# EAGLE design RTC (EAGLE 5.10)
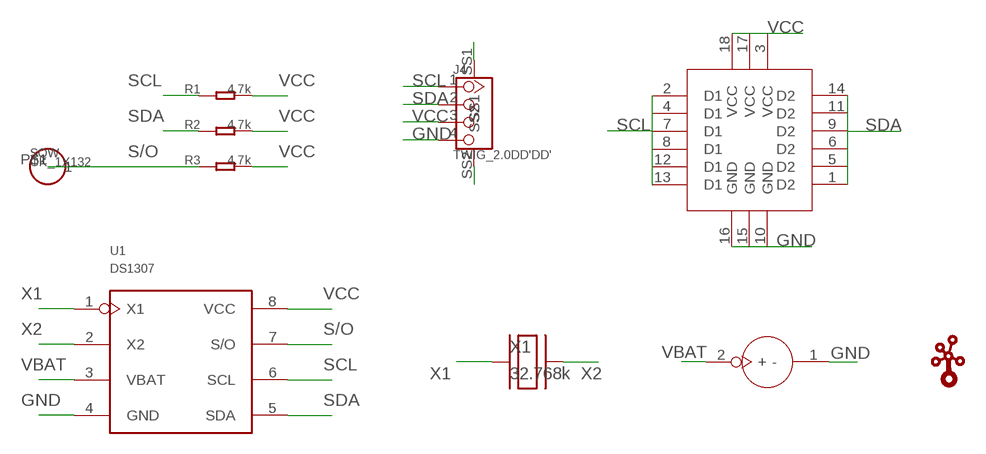
[diagram p0: schematic, sheet 1]

## Parts
J4  TWIG_2.0DD'DD'  [2.0_1X4DD]
R1  4.7k  R0603  [0603]
R2  4.7k  R0603  [0603]
R3  4.7k  R0603  [0603]
SQW  CK_1X132  [CK_1X1]
TWIG1  TWIG-U2  [U2]
U1  DS1307  [SO08]
U3  BATTERYBATTERY1225_SMT  [BATTERY1225_SMT]
U$2  TWIGLOGOTWIGLOGO_SMALL  [TWIGLOGO_SMALL]
X1  32.768k  XTL_S  [XTL_S]

## Nets
GND: J4.4 J4.SS1 J4.SS2 TWIG1.10(GND) TWIG1.15(GND) TWIG1.16(GND) U1.4(GND) U3.1(-)
S/O: R3.1 SQW.P$1 U1.7(S/O)
SCL: J4.1 R1.1 TWIG1.2(D1) TWIG1.4(D1) TWIG1.7(D1) TWIG1.8(D1) TWIG1.12(D1) TWIG1.13(D1) U1.6(SCL)
SDA: J4.2 R2.1 TWIG1.1(D2) TWIG1.5(D2) TWIG1.6(D2) TWIG1.9(D2) TWIG1.11(D2) TWIG1.14(D2) U1.5(SDA)
VBAT: U1.3(VBAT) U3.2(+)
VCC: J4.3 R1.2 R2.2 R3.2 TWIG1.3(VCC) TWIG1.17(VCC) TWIG1.18(VCC) U1.8(VCC)
X1: U1.1(X1) X1.1
X2: U1.2(X2) X1.2

## Library data of the parts
J4 = CONNECTER:TWIG_2.0DD
R1-R3 = CPT_SMD:R0603
SQW = CONNECTER:CK_1X1
TWIG1 = twig_template2:TWIG-U2
U1 = Seeed:DS1307
U3 = seeedleo:BATTERY
U$2 = seeedleo:TWIGLOGO
X1 = CPT_CJ:XTL_S

## Board
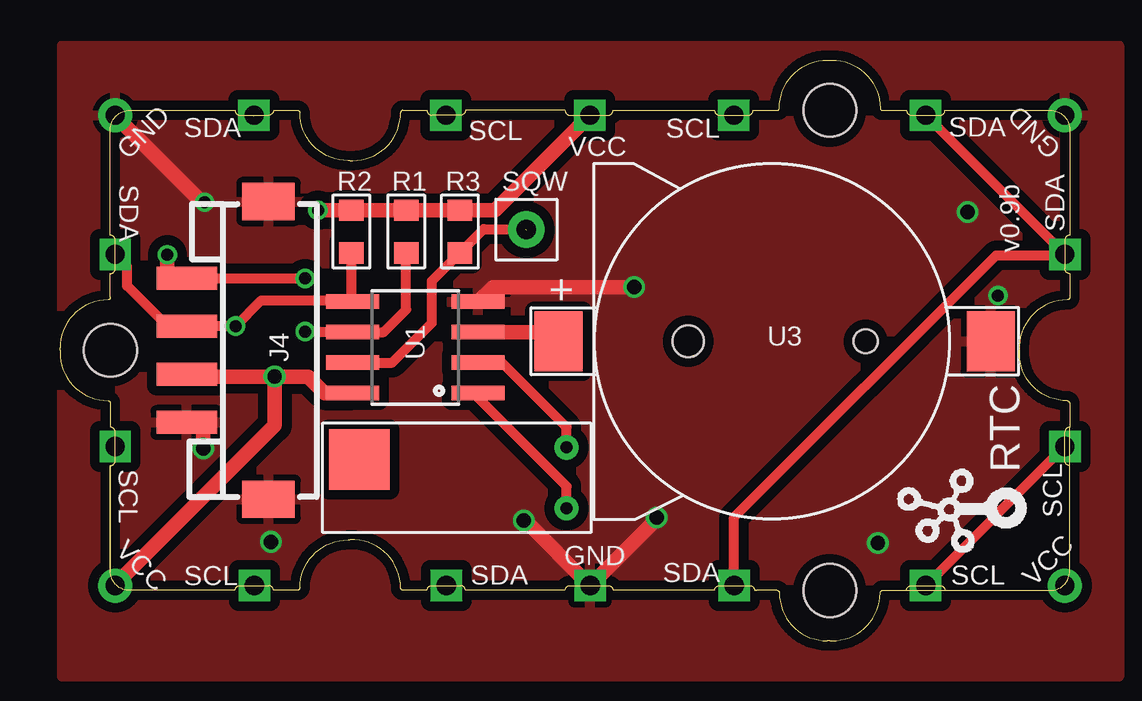
[diagram p1: board, top side]
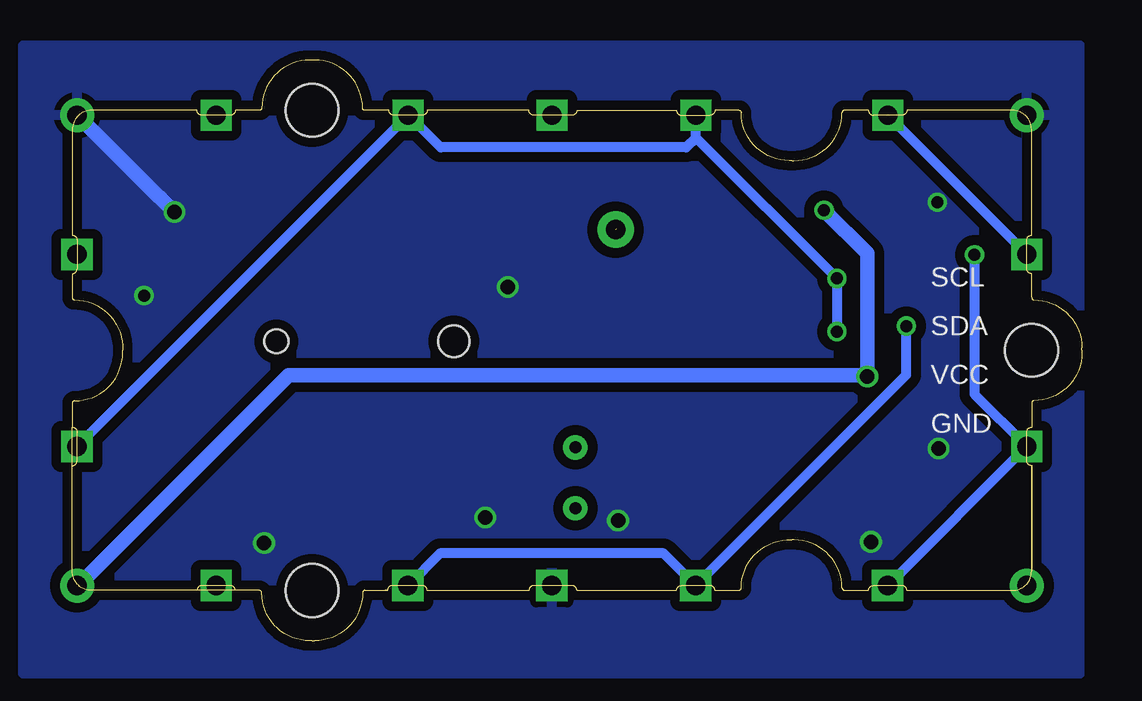
[diagram p2: board, bottom side, seen from below]

Size 42.09 x 24.2 mm. Coordinates in mm from the lower left corner, seen from the top.
Copper layers (1*16): Top 0.035mm / dielectric 1.5mm / Bottom 0.035mm
Design rules "SeeedStudio_rule_no_angle_090911": minimum track width 6mil, minimum drill 12mil, track to track 6mil, track to pad 6mil, pad to pad 6mil, via to via 6mil, smd to smd 0mil, copper to edge 10mil, drill to drill 10mil, minimum pad ring 10mil, minimum via ring 6mil, stop-mask expansion 2mil, vias tented up to drill 100mil, thermal gap 10mil

### Footprints (pad centres in the part's own frame; a part is rotated, then mirrored left to right if it is on the bottom)
2.0_1X4DD = smd 0.965 x 2.54: 1 -3,0; 2 -1,0; 3 1,0; 4 3,0 | smd 1.55 x 2.184: SS1 -6.2,3.4; SS2 6.2,3.4
0603 = smd 0.889 x 1.016: 1 -0.889,0; 2 0.889,0
CK_1X1 = drill 0.813 pad 1.524 round: P$1 0,0
U2 = drill 0.8 pad 1.27 square: 1 -13.965,9.8; 2 -5.965,9.8; 3 0.035,9.8; 4 6.035,9.8; 5 14.035,9.8; 6 19.835,4; 7 19.835,-4; 8 14.035,-9.8; 9 6.045,-9.8; 10 0.045,-9.8; 11 -5.955,-9.8; 12 -13.955,-9.8; 13 -19.755,-4; 14 -19.755,4 | drill 0.8 pad 1.422 round: 15 -19.755,9.8; 16 19.835,9.8; 17 19.835,-9.8; 18 -19.755,-9.8 | hole 2.2: 10.033,-10; 10.033,10; -19.955,0.005
SO08 = smd 0.61 x 2.21: 1 -1.905,-2.616; 2 -0.635,-2.616; 3 0.635,-2.616; 4 1.905,-2.616; 5 1.905,2.616; 6 0.635,2.616; 7 -0.635,2.616; 8 -1.905,2.616
BATTERY1225_SMT = smd 2 x 2.5: 1 -9.119,0; 2 8.89,0 | hole 1: -3.913,0 | hole 1.3: 3.487,0
XTL_S = drill 0.508 round: 1 0,0; 2 0,-2.54 | smd 2.54 x 2.54:  8.636,-2.032

### Placement (x,y rotation side)
J4  5.29,12.1 270 top
R1  14.43,17.05 90 top
R2  12.15,17.05 90 top
R3  16.67,17.05 90 top
SQW  19.44,17.13 270 top
TWIG1  22.05,12.1 0 top
U1  14.82,12.23 90 top
U3  29.67,12.48 180 top
U$2  40.42,3.29 90 top
X1  21.12,5.52 180 top

### Tracks (layer width: path | path; a pad name or v marks a point on that pad's centre or on a via)
GND  (via drill 0.5, 0.6)
  Top 0.61: v19.34,5.01 19.39,5.01 TWIG1.10 24.94,5.14 v24.87,5.14 | TWIG1.15 2.3,21.87 5.9,18.27 v6.03,18.27 | J4.SS1 8.66,18.27 | v5.98,8.01 5.98,9.05 5.93,9.1 J4.4 | v23.93,14.74 18.04,14.74 U1.4
  Bottom 0.61: TWIG1.16 38.49,18.5 38.46,18.5 v37.83,17.87 | v6.03,18.27 5.98,18.22
  other vias: 34.09,4.07 39.1,14.39 8.8,4.12
  pour Top (isolate 0.406): 0.08,24.8 44.15,24.8 44.15,-1.49 0.08,-1.49
  pour Bottom (isolate 0.406): 0.08,24.8 44.15,24.8 44.15,-1.36 0.08,-1.36
S/O  (1 unrouted)
  Top 0.406: U1.7 13.85,11.59 15.5,13.24 15.5,15 R3.1 | R3.1 16.75,16.16 | 19.41,17.16 17.66,17.16 R3.1
SCL  (via drill 0.5)
  Top 0.406: TWIG1.7 TWIG1.8 | J4.1 v10.22,15.1 | v10.22,12.89 12.17,12.89 U1.6 13.49,12.86 14.43,13.8 R1.1
  Top 0.61: J4.1 4.56,15.1 4.48,15.02 v4.48,16.09
  Bottom 0.406: TWIG1.12 TWIG1.13 4.48,10.28 v4.48,16.09 | TWIG1.7 TWIG1.4 28.07,21.9 26.73,20.56 16.5,20.56 16.09,20.97 | v10.22,12.89 v10.22,15.1 16.09,20.97 | 16.09,20.97 TWIG1.2
SDA  (via drill 0.5)  (1 unrouted)
  Top 0.406: 12.15,14.18 R2.1 | 12.15,14.18 U1.5 | 12.15,14.18 8.39,14.18 v7.32,13.12 6.04,13.12 J4.2 4.49,13.1 2.8,14.79 2.8,15.6 TWIG1.14 | TWIG1.9 28.1,5.14 39.02,16.06 41.85,16.06 TWIG1.6 TWIG1.5
  Bottom 0.406: TWIG1.9 26.76,3.64 17.44,3.64 TWIG1.11 7.32,11.08 v7.32,13.12 | 8.08,21.88 TWIG1.14
VBAT
  Top 0.406: 20.63,12.86 U3.2
  Top 0.61: U1.3 20.63,12.86
VCC  (via drill 0.5, 0.6)
  Top 0.61: v10.75,17.94 R2.2 R1.2 R3.2 18.13,17.94 TWIG1.3 | U1.8 11.03,10.32 10.35,11.01 v8.95,11.01 | v8.95,11.01 5.38,11.01 J4.3 | TWIG1.18 2.3,2.33 8.95,8.98 v8.95,11.01
  Bottom 0.61: TWIG1.17 41.84,2.3 33.08,11.06 9,11.06 v8.95,11.01 8.95,16.14 v10.75,17.94
X1
  Top 0.406: X1.1 21.11,6.44 17.43,10.12 U1.1
X2
  Top 0.406: U1.2 18.42,11.59 21.11,8.9 X1.2

### Text on the board
tPlace: SDA | SCL | SCL | SDA | GND | GND | VCC | SDA | SDA | v0.9b | SCL | RTC | SCL | VCC | GND | SDA | SCL | SDA | SCL | VCC
bPlace: SCL | SDA | VCC | GND